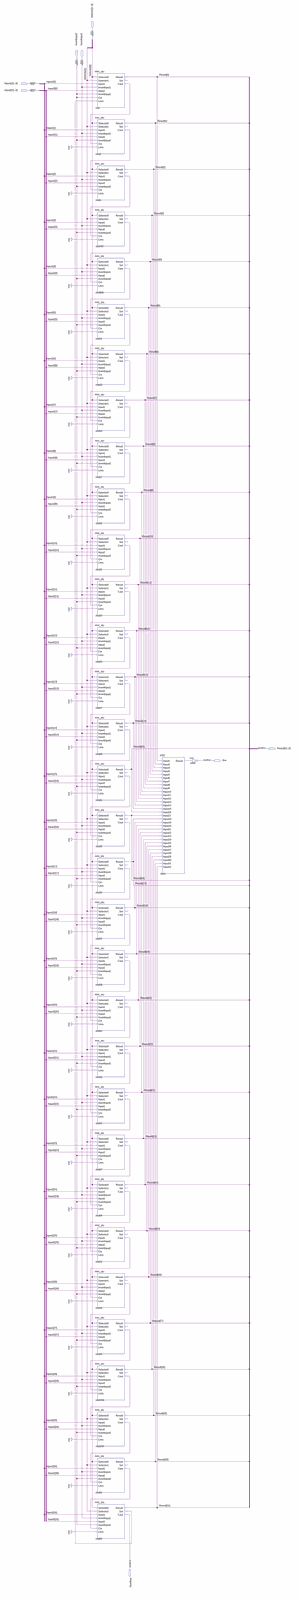
[diagram p0: schematic sheet, whole]
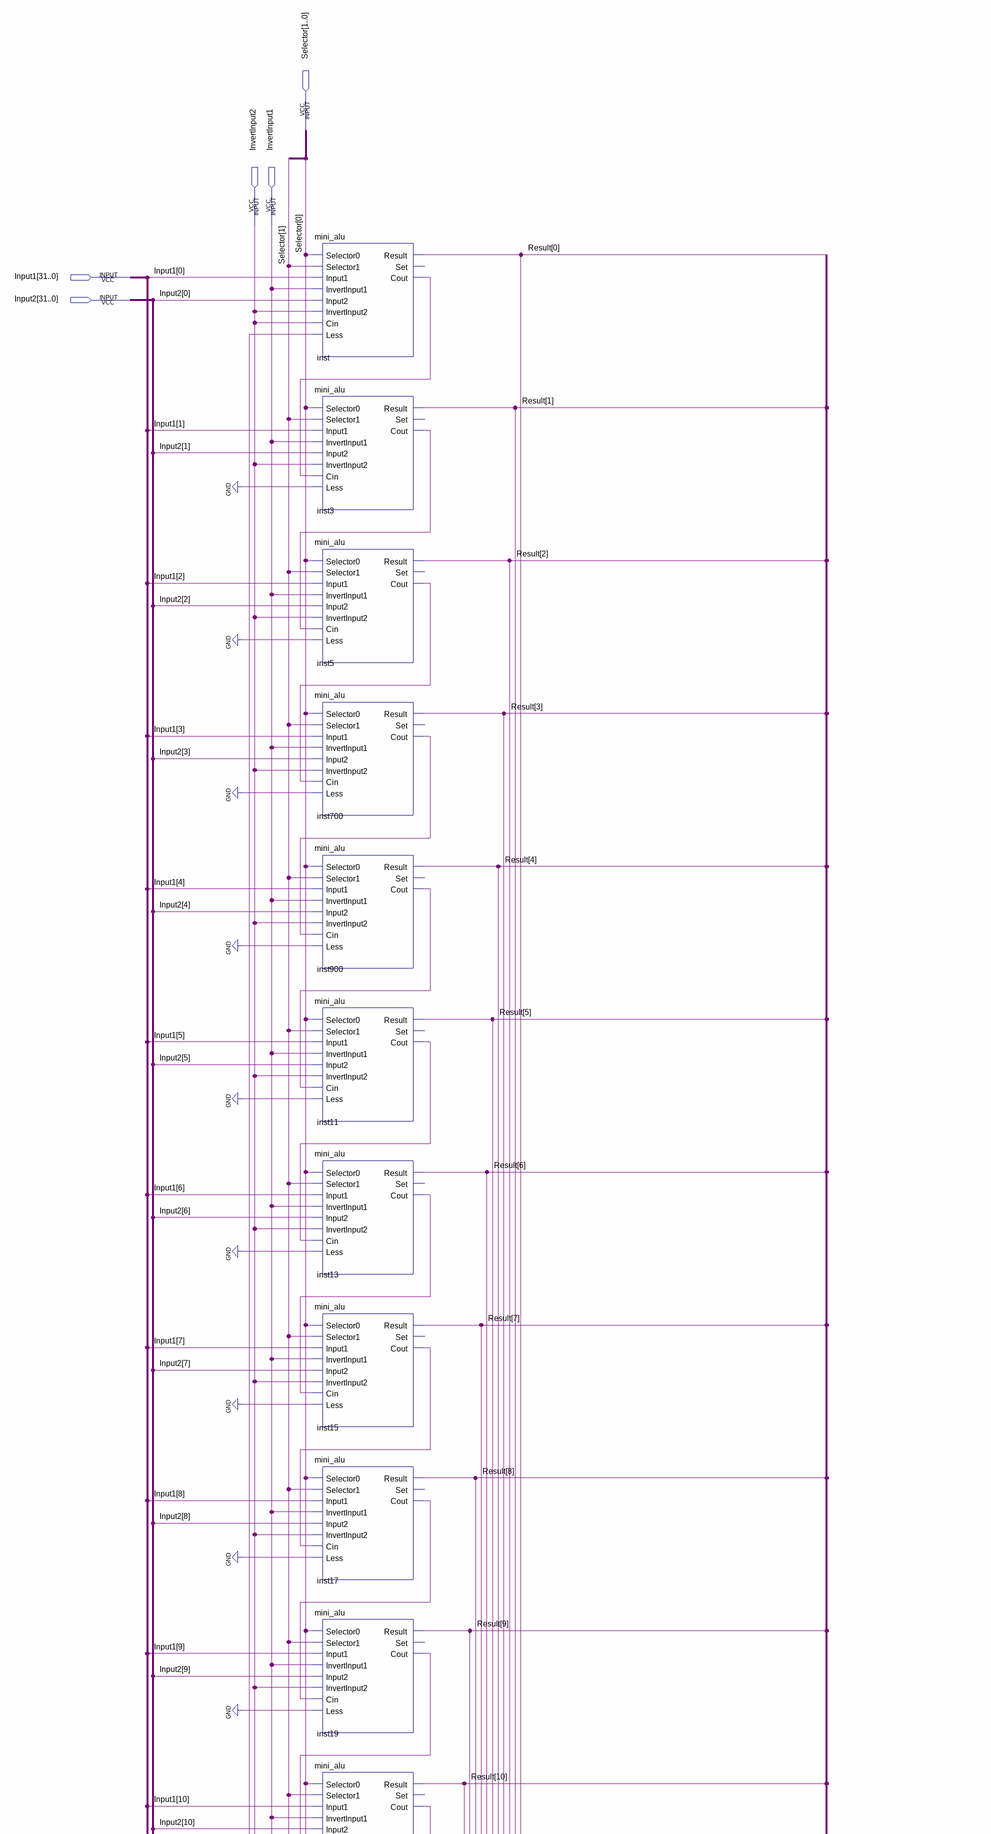
[diagram p1: schematic sheet, upper part]
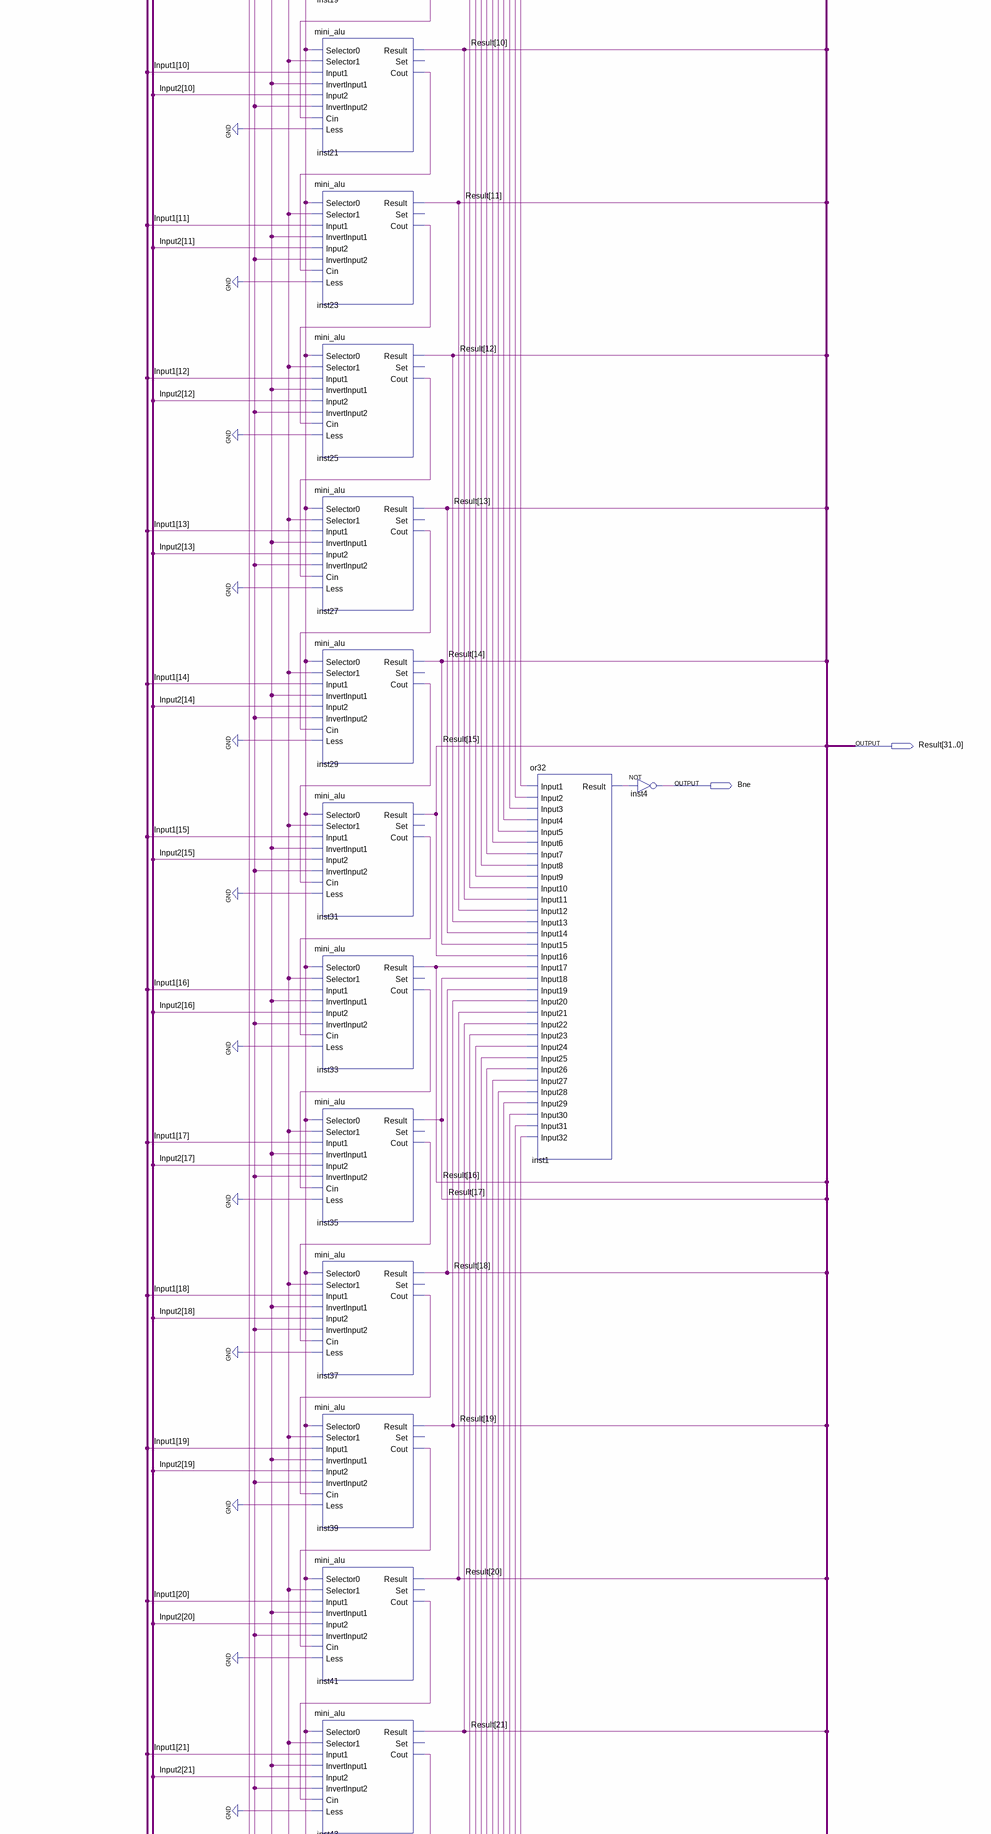
[diagram p2: schematic sheet, middle part]
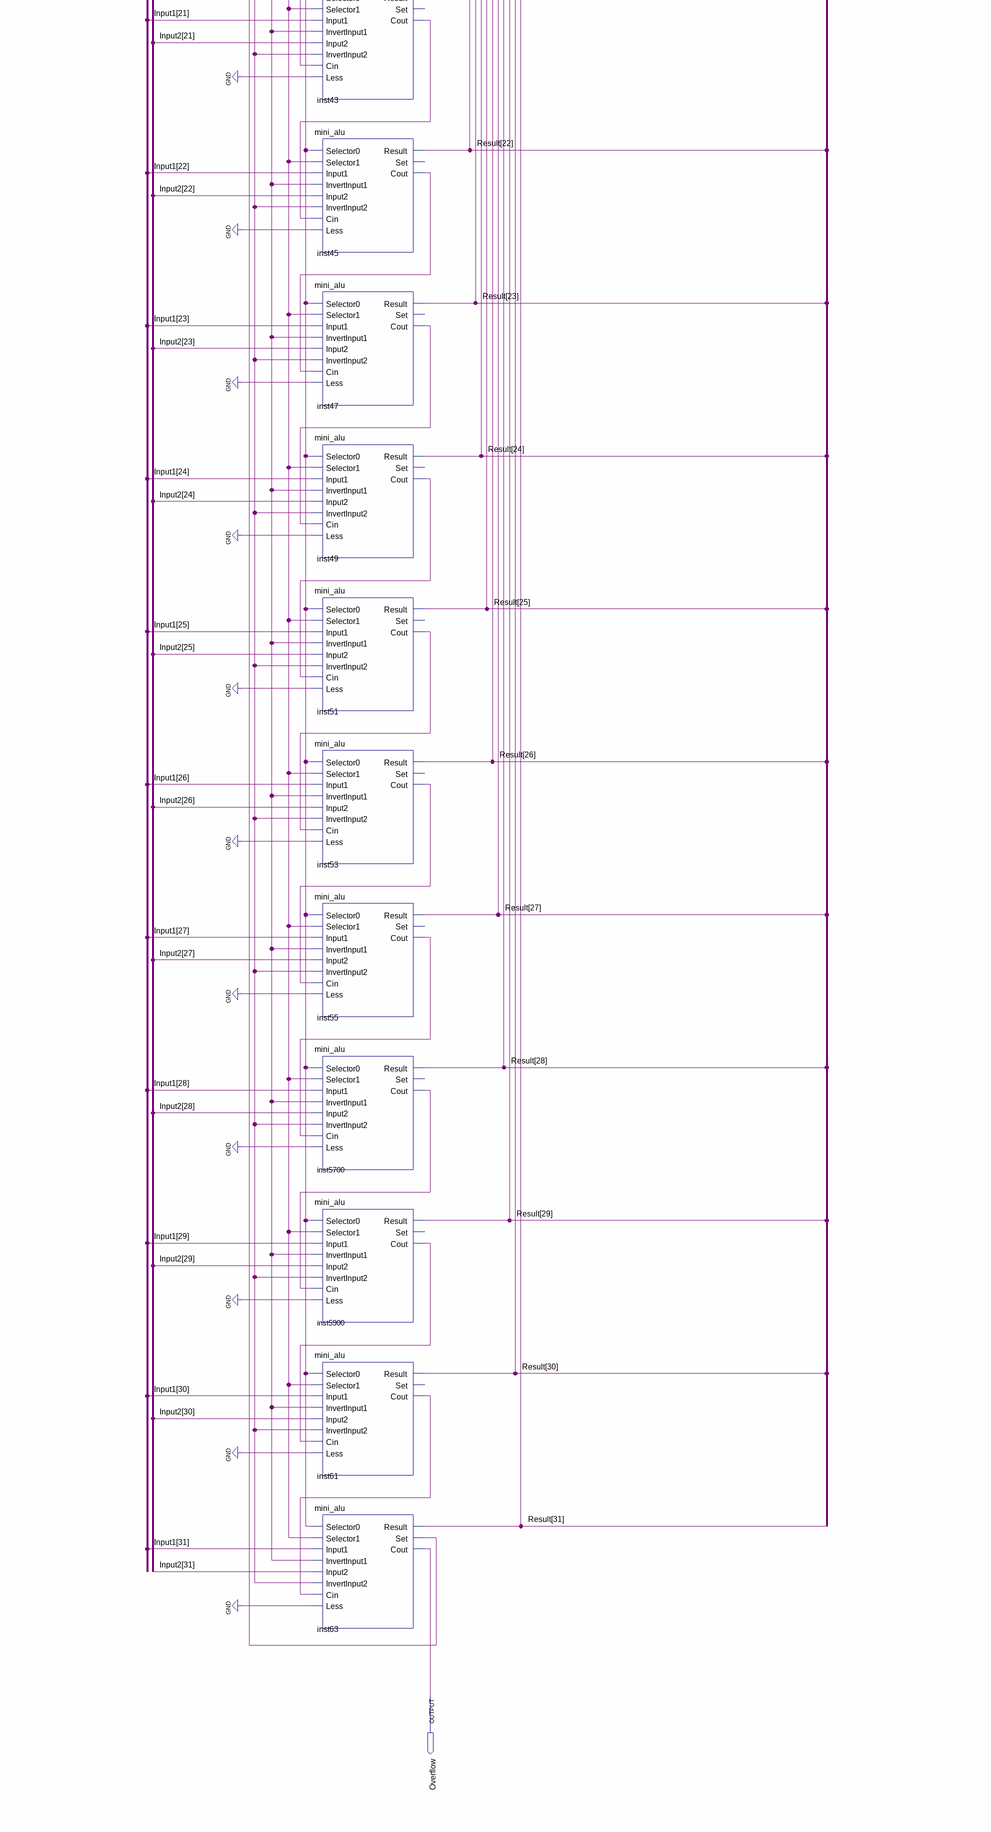
[diagram p3: schematic sheet, lower part]
// Quartus schematic alu32bit.bdf as structural Verilog: 34 symbols, 8 pins
module alu32bit (
  input  [1:0] Selector,
  input  InvertInput2,
  input  InvertInput1,
  input  [31:0] Input1,
  input  [31:0] Input2,
  output [31:0] Result,
  output Bne,
  output Overflow
);

  wire inst1_result, inst3_cout, inst5_cout, inst11_cout, inst13_cout, inst15_cout, inst17_cout, inst19_cout,
       inst21_cout, inst23_cout, inst25_cout, inst27_cout, inst29_cout, inst31_cout, inst33_cout,
       inst35_cout, inst37_cout, inst39_cout, inst41_cout, inst43_cout, inst45_cout, inst47_cout,
       inst49_cout, inst51_cout, inst53_cout, inst55_cout, inst61_cout, inst63_set, inst700_cout,
       inst900_cout, inst5700_cout, inst5900_cout, inst_cout;

  mini_alu inst (
    .Selector0(Selector[0]), .Selector1(Selector[1]), .Input1(Input1[0]), .InvertInput1(InvertInput1),
    .Input2(Input2[0]), .InvertInput2(InvertInput2), .Cin(InvertInput2), .Less(inst63_set),
    .Result(Result[0]), .Cout(inst_cout));  // open: Set
  mini_alu inst3 (
    .Selector0(Selector[0]), .Selector1(Selector[1]), .Input1(Input1[1]), .InvertInput1(InvertInput1),
    .Input2(Input2[1]), .InvertInput2(InvertInput2), .Cin(inst_cout), .Less(1'b0), .Result(Result[1]),
    .Cout(inst3_cout));  // open: Set
  mini_alu inst5 (
    .Selector0(Selector[0]), .Selector1(Selector[1]), .Input1(Input1[2]), .InvertInput1(InvertInput1),
    .Input2(Input2[2]), .InvertInput2(InvertInput2), .Cin(inst3_cout), .Less(1'b0), .Result(Result[2]),
    .Cout(inst5_cout));  // open: Set
  mini_alu inst700 (
    .Selector0(Selector[0]), .Selector1(Selector[1]), .Input1(Input1[3]), .InvertInput1(InvertInput1),
    .Input2(Input2[3]), .InvertInput2(InvertInput2), .Cin(inst5_cout), .Less(1'b0), .Result(Result[3]),
    .Cout(inst700_cout));  // open: Set
  mini_alu inst900 (
    .Selector0(Selector[0]), .Selector1(Selector[1]), .Input1(Input1[4]), .InvertInput1(InvertInput1),
    .Input2(Input2[4]), .InvertInput2(InvertInput2), .Cin(inst700_cout), .Less(1'b0), .Result(Result[4]),
    .Cout(inst900_cout));  // open: Set
  mini_alu inst11 (
    .Selector0(Selector[0]), .Selector1(Selector[1]), .Input1(Input1[5]), .InvertInput1(InvertInput1),
    .Input2(Input2[5]), .InvertInput2(InvertInput2), .Cin(inst900_cout), .Less(1'b0), .Result(Result[5]),
    .Cout(inst11_cout));  // open: Set
  mini_alu inst13 (
    .Selector0(Selector[0]), .Selector1(Selector[1]), .Input1(Input1[6]), .InvertInput1(InvertInput1),
    .Input2(Input2[6]), .InvertInput2(InvertInput2), .Cin(inst11_cout), .Less(1'b0), .Result(Result[6]),
    .Cout(inst13_cout));  // open: Set
  mini_alu inst15 (
    .Selector0(Selector[0]), .Selector1(Selector[1]), .Input1(Input1[7]), .InvertInput1(InvertInput1),
    .Input2(Input2[7]), .InvertInput2(InvertInput2), .Cin(inst13_cout), .Less(1'b0), .Result(Result[7]),
    .Cout(inst15_cout));  // open: Set
  mini_alu inst17 (
    .Selector0(Selector[0]), .Selector1(Selector[1]), .Input1(Input1[8]), .InvertInput1(InvertInput1),
    .Input2(Input2[8]), .InvertInput2(InvertInput2), .Cin(inst15_cout), .Less(1'b0), .Result(Result[8]),
    .Cout(inst17_cout));  // open: Set
  mini_alu inst19 (
    .Selector0(Selector[0]), .Selector1(Selector[1]), .Input1(Input1[9]), .InvertInput1(InvertInput1),
    .Input2(Input2[9]), .InvertInput2(InvertInput2), .Cin(inst17_cout), .Less(1'b0), .Result(Result[9]),
    .Cout(inst19_cout));  // open: Set
  mini_alu inst21 (
    .Selector0(Selector[0]), .Selector1(Selector[1]), .Input1(Input1[10]), .InvertInput1(InvertInput1),
    .Input2(Input2[10]), .InvertInput2(InvertInput2), .Cin(inst19_cout), .Less(1'b0), .Result(Result[10]),
    .Cout(inst21_cout));  // open: Set
  mini_alu inst23 (
    .Selector0(Selector[0]), .Selector1(Selector[1]), .Input1(Input1[11]), .InvertInput1(InvertInput1),
    .Input2(Input2[11]), .InvertInput2(InvertInput2), .Cin(inst21_cout), .Less(1'b0), .Result(Result[11]),
    .Cout(inst23_cout));  // open: Set
  mini_alu inst25 (
    .Selector0(Selector[0]), .Selector1(Selector[1]), .Input1(Input1[12]), .InvertInput1(InvertInput1),
    .Input2(Input2[12]), .InvertInput2(InvertInput2), .Cin(inst23_cout), .Less(1'b0), .Result(Result[12]),
    .Cout(inst25_cout));  // open: Set
  mini_alu inst27 (
    .Selector0(Selector[0]), .Selector1(Selector[1]), .Input1(Input1[13]), .InvertInput1(InvertInput1),
    .Input2(Input2[13]), .InvertInput2(InvertInput2), .Cin(inst25_cout), .Less(1'b0), .Result(Result[13]),
    .Cout(inst27_cout));  // open: Set
  mini_alu inst29 (
    .Selector0(Selector[0]), .Selector1(Selector[1]), .Input1(Input1[14]), .InvertInput1(InvertInput1),
    .Input2(Input2[14]), .InvertInput2(InvertInput2), .Cin(inst27_cout), .Less(1'b0), .Result(Result[14]),
    .Cout(inst29_cout));  // open: Set
  mini_alu inst31 (
    .Selector0(Selector[0]), .Selector1(Selector[1]), .Input1(Input1[15]), .InvertInput1(InvertInput1),
    .Input2(Input2[15]), .InvertInput2(InvertInput2), .Cin(inst29_cout), .Less(1'b0), .Result(Result[15]),
    .Cout(inst31_cout));  // open: Set
  mini_alu inst33 (
    .Selector0(Selector[0]), .Selector1(Selector[1]), .Input1(Input1[16]), .InvertInput1(InvertInput1),
    .Input2(Input2[16]), .InvertInput2(InvertInput2), .Cin(inst31_cout), .Less(1'b0), .Result(Result[16]),
    .Cout(inst33_cout));  // open: Set
  mini_alu inst35 (
    .Selector0(Selector[0]), .Selector1(Selector[1]), .Input1(Input1[17]), .InvertInput1(InvertInput1),
    .Input2(Input2[17]), .InvertInput2(InvertInput2), .Cin(inst33_cout), .Less(1'b0), .Result(Result[17]),
    .Cout(inst35_cout));  // open: Set
  mini_alu inst37 (
    .Selector0(Selector[0]), .Selector1(Selector[1]), .Input1(Input1[18]), .InvertInput1(InvertInput1),
    .Input2(Input2[18]), .InvertInput2(InvertInput2), .Cin(inst35_cout), .Less(1'b0), .Result(Result[18]),
    .Cout(inst37_cout));  // open: Set
  mini_alu inst39 (
    .Selector0(Selector[0]), .Selector1(Selector[1]), .Input1(Input1[19]), .InvertInput1(InvertInput1),
    .Input2(Input2[19]), .InvertInput2(InvertInput2), .Cin(inst37_cout), .Less(1'b0), .Result(Result[19]),
    .Cout(inst39_cout));  // open: Set
  mini_alu inst41 (
    .Selector0(Selector[0]), .Selector1(Selector[1]), .Input1(Input1[20]), .InvertInput1(InvertInput1),
    .Input2(Input2[20]), .InvertInput2(InvertInput2), .Cin(inst39_cout), .Less(1'b0), .Result(Result[20]),
    .Cout(inst41_cout));  // open: Set
  mini_alu inst43 (
    .Selector0(Selector[0]), .Selector1(Selector[1]), .Input1(Input1[21]), .InvertInput1(InvertInput1),
    .Input2(Input2[21]), .InvertInput2(InvertInput2), .Cin(inst41_cout), .Less(1'b0), .Result(Result[21]),
    .Cout(inst43_cout));  // open: Set
  mini_alu inst45 (
    .Selector0(Selector[0]), .Selector1(Selector[1]), .Input1(Input1[22]), .InvertInput1(InvertInput1),
    .Input2(Input2[22]), .InvertInput2(InvertInput2), .Cin(inst43_cout), .Less(1'b0), .Result(Result[22]),
    .Cout(inst45_cout));  // open: Set
  mini_alu inst47 (
    .Selector0(Selector[0]), .Selector1(Selector[1]), .Input1(Input1[23]), .InvertInput1(InvertInput1),
    .Input2(Input2[23]), .InvertInput2(InvertInput2), .Cin(inst45_cout), .Less(1'b0), .Result(Result[23]),
    .Cout(inst47_cout));  // open: Set
  mini_alu inst49 (
    .Selector0(Selector[0]), .Selector1(Selector[1]), .Input1(Input1[24]), .InvertInput1(InvertInput1),
    .Input2(Input2[24]), .InvertInput2(InvertInput2), .Cin(inst47_cout), .Less(1'b0), .Result(Result[24]),
    .Cout(inst49_cout));  // open: Set
  mini_alu inst51 (
    .Selector0(Selector[0]), .Selector1(Selector[1]), .Input1(Input1[25]), .InvertInput1(InvertInput1),
    .Input2(Input2[25]), .InvertInput2(InvertInput2), .Cin(inst49_cout), .Less(1'b0), .Result(Result[25]),
    .Cout(inst51_cout));  // open: Set
  mini_alu inst53 (
    .Selector0(Selector[0]), .Selector1(Selector[1]), .Input1(Input1[26]), .InvertInput1(InvertInput1),
    .Input2(Input2[26]), .InvertInput2(InvertInput2), .Cin(inst51_cout), .Less(1'b0), .Result(Result[26]),
    .Cout(inst53_cout));  // open: Set
  mini_alu inst55 (
    .Selector0(Selector[0]), .Selector1(Selector[1]), .Input1(Input1[27]), .InvertInput1(InvertInput1),
    .Input2(Input2[27]), .InvertInput2(InvertInput2), .Cin(inst53_cout), .Less(1'b0), .Result(Result[27]),
    .Cout(inst55_cout));  // open: Set
  mini_alu inst5700 (
    .Selector0(Selector[0]), .Selector1(Selector[1]), .Input1(Input1[28]), .InvertInput1(InvertInput1),
    .Input2(Input2[28]), .InvertInput2(InvertInput2), .Cin(inst55_cout), .Less(1'b0), .Result(Result[28]),
    .Cout(inst5700_cout));  // open: Set
  mini_alu inst5900 (
    .Selector0(Selector[0]), .Selector1(Selector[1]), .Input1(Input1[29]), .InvertInput1(InvertInput1),
    .Input2(Input2[29]), .InvertInput2(InvertInput2), .Cin(inst5700_cout), .Less(1'b0), .Result(Result[29]),
    .Cout(inst5900_cout));  // open: Set
  mini_alu inst61 (
    .Selector0(Selector[0]), .Selector1(Selector[1]), .Input1(Input1[30]), .InvertInput1(InvertInput1),
    .Input2(Input2[30]), .InvertInput2(InvertInput2), .Cin(inst5900_cout), .Less(1'b0), .Result(Result[30]),
    .Cout(inst61_cout));  // open: Set
  mini_alu inst63 (
    .Selector0(Selector[0]), .Selector1(Selector[1]), .Input1(Input1[31]), .InvertInput1(InvertInput1),
    .Input2(Input2[31]), .InvertInput2(InvertInput2), .Cin(inst61_cout), .Less(1'b0), .Result(Result[31]),
    .Set(inst63_set), .Cout(Overflow));
  or32 inst1 (
    .Input1(Result[0]), .Input2(Result[1]), .Input3(Result[2]), .Input4(Result[3]), .Input5(Result[4]),
    .Input6(Result[5]), .Input7(Result[6]), .Input8(Result[7]), .Input9(Result[8]), .Input10(Result[9]),
    .Input11(Result[10]), .Input12(Result[11]), .Input13(Result[12]), .Input14(Result[13]),
    .Input15(Result[14]), .Input16(Result[15]), .Input17(Result[16]), .Input18(Result[17]),
    .Input19(Result[18]), .Input20(Result[19]), .Input21(Result[20]), .Input22(Result[21]),
    .Input23(Result[22]), .Input24(Result[23]), .Input25(Result[24]), .Input26(Result[25]),
    .Input27(Result[26]), .Input28(Result[27]), .Input29(Result[28]), .Input30(Result[29]),
    .Input31(Result[30]), .Input32(Result[31]), .Result(inst1_result));
  not inst4 (Bne, inst1_result);
endmodule
